# Altium schematic sheet H01R0_Frontend 1.SchDoc
size Letter; CompanyName: Hexabitz; DocumentNumber: 2; SheetNumber: 2; SheetTotal: 3
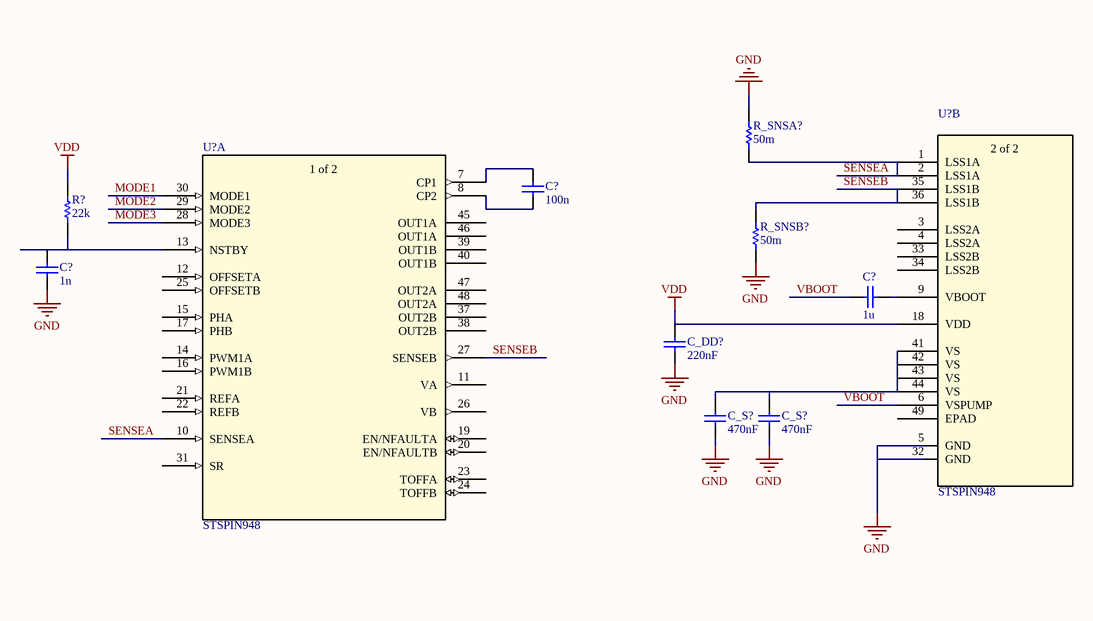
[diagram p0: H01R0_Frontend 1.SchDoc]

## Parts
(Parts that share a designator on the sheet are numbered #1, #2 ... from top to bottom, then left to right.)
C?#1  value 100n  (hidden comment: Capacitor)
C?#2  value 1n  (hidden comment: Capacitor)
C?#3  value 1u  (hidden comment: Capacitor)
C_DD?  value 220nF  (hidden comment: Capacitor)
C_S?#1  value 470nF  (hidden comment: Capacitor)
C_S?#2  value 470nF  (hidden comment: Capacitor)
R?  value 22k  (hidden comment: Resistor)
R_SNSA?  value 50m  (hidden comment: Resistor)
R_SNSB?  value 50m  (hidden comment: Resistor)
U?#1  STSPIN948  [VFQFPN48_7P15X7P15X0P5_STM]  (part B of 2)
U?#2  STSPIN948  [VFQFPN48_7P15X7P15X0P5_STM]  (part A of 2)

## Nets
GND: C?#2.2 C_DD?.2 C_S?#1.2 C_S?#2.2 R_SNSA?.1 R_SNSB?.1 U?#1.5(GND) U?#1.32(GND)
VDD: C_DD?.1 R?.1 U?#1.18(VDD)
MODE1: U?#2.30(MODE1)
MODE~{2}: U?#2.29(MODE2)
MODE3: U?#2.28(MODE3)
SENSEA: R_SNSA?.2 U?#1.1(LSS1A) U?#1.2(LSS1A) U?#2.10(SENSEA)
SENSEB: R_SNSB?.2 U?#1.35(LSS1B) U?#1.36(LSS1B) U?#2.27(SENSEB)
VBOOT: C?#3.2 U?#1.6(VSPUMP)
NetC?#1_1: C?#1.1 U?#2.7(CP1)
NetC?#1_2: C?#1.2 U?#2.8(CP2)
NetC?#2_1: C?#2.1 R?.2 U?#2.13(NSTBY)
NetC?#3_1: C?#3.1 U?#1.9(VBOOT)
NetC_S?#1_1: C_S?#1.1 C_S?#2.1 U?#1.41(VS) U?#1.42(VS) U?#1.43(VS) U?#1.44(VS)

Not connected (* = marked no-connect by the designer): U?#1 3(LSS2A) 4(LSS2A) 33(LSS2B) 34(LSS2B) 49(EPAD); U?#2 11(VA) 12(OFFSETA) 14(PWM1A) 15(PHA) 16(PWM1B) 17(PHB) 19(EN/NFAULTA) 20(EN/NFAULTB) 21(REFA) 22(REFB) 23(TOFFA) 24(TOFFB) 25(OFFSETB) 26(VB) 31(SR) 37(OUT2B) 38(OUT2B) 39(OUT1B) 40(OUT1B) 45(OUT1A) 46(OUT1A) 47(OUT2A) 48(OUT2A)

## Notes on the sheet
- Module:
- Title:
- Description:
- Size:
- Revision:
- Letter
- www.hexabitz.com
- Date:
- Time:
- Sheet
- of
- (in symbol STSPIN948, part A) 1 of 2
- (in symbol STSPIN948, part B) 2 of 2

## Library data of the parts
C?#1-C?#3 C_DD? C_S?#1 C_S?#2 = Capacitor: SimulationGenericComponent: True
R? R_SNSA? R_SNSB? = Resistor: TC1: 0; SimulationGenericComponent: True; TC2: 0
U?#1 U?#2 = STSPIN948: Scalable 4.5 A dual full-bridge driver for brushed DC motors; Manufacturer_Name: STMicroelectronics; Type: Power Management; Copyright: Copyright (C) 2025 Ultra Librarian. All rights reserved.; Manufacturer_Part_Number: STSPIN948; Datasheet: https://www.st.com/resource/en/datasheet/stspin948.pdf; RefDes: RefDes